# Altium schematic sheet Peripherals.SchDoc
size A4
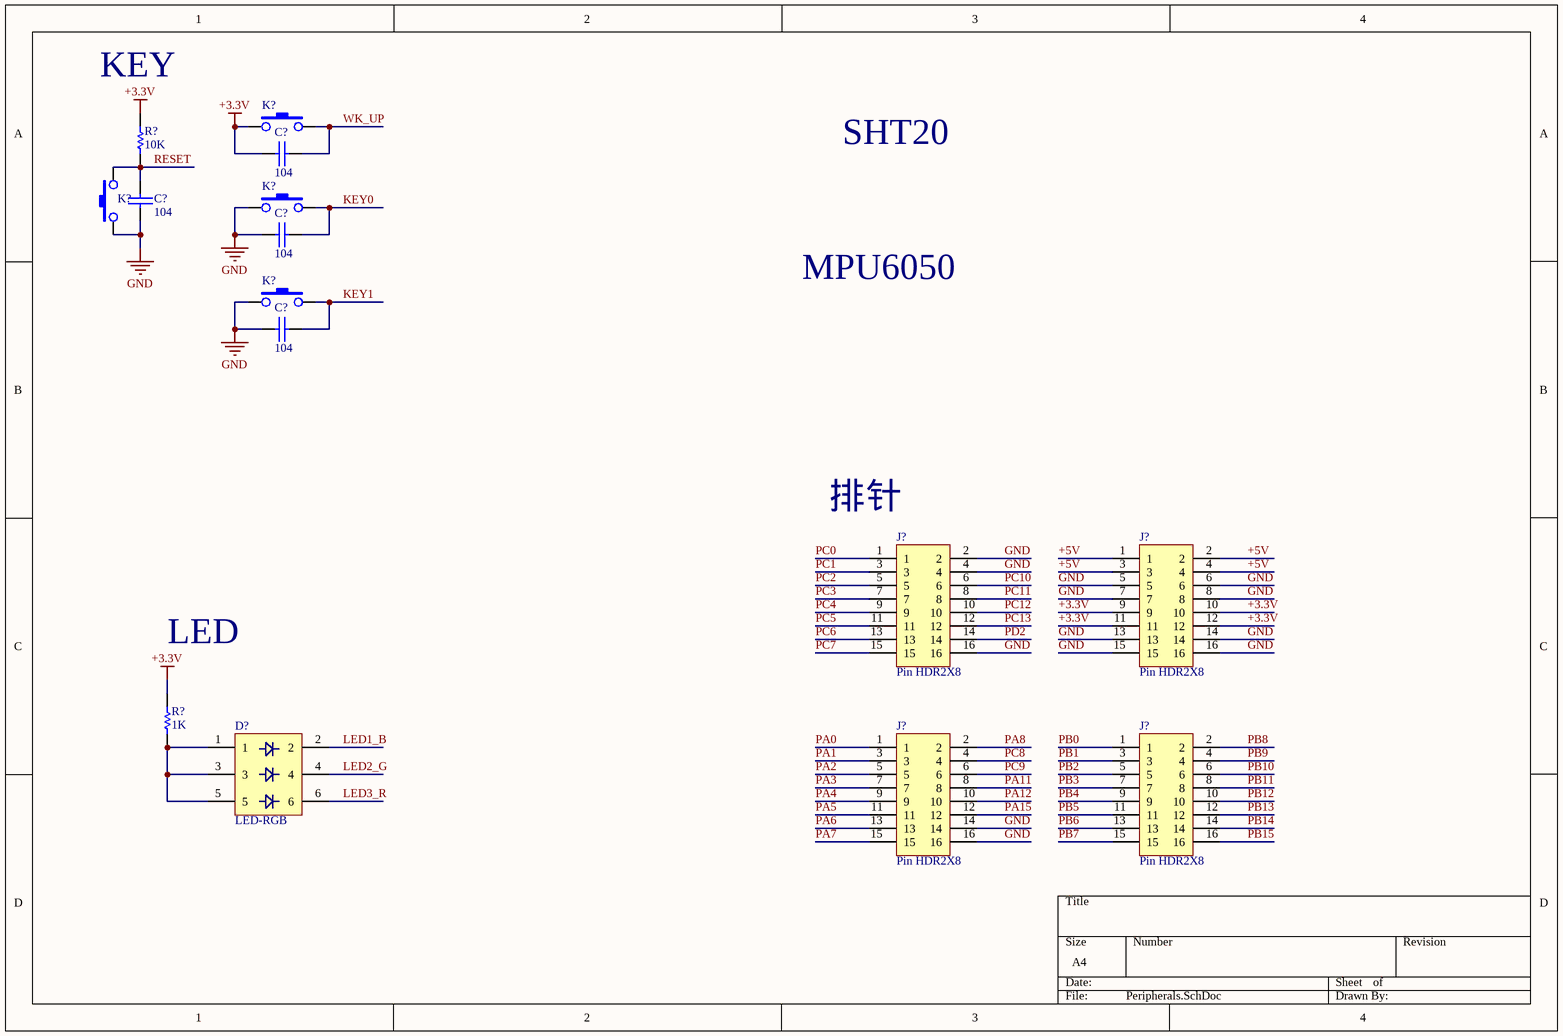
[diagram p0: Peripherals.SchDoc]

## Parts
(Parts that share a designator on the sheet are numbered #1, #2 ... from top to bottom, then left to right.)
C?#1  104  [0603C]
C?#2  104  [0603C]
C?#3  104  [0603C]
C?#4  104  [0603C]
D?  LED-RGB  [LED-5050W]
J?#1  Pin HDR2X8  [Pin HDR2X8/2.54mm-S]
J?#2  Pin HDR2X8  [Pin HDR2X8/2.54mm-S]
J?#3  Pin HDR2X8  [Pin HDR2X8/2.54mm-S]
J?#4  Pin HDR2X8  [Pin HDR2X8/2.54mm-S]
K?#1  KEY  [DIP-6X6X5]  (value not drawn)
K?#2  KEY  [DIP-6X6X5]  (value not drawn)
K?#3  KEY  [DIP-6X6X5]  (value not drawn)
K?#4  KEY  [DIP-6X6X5]  (value not drawn)
R?#1  10K  [0603R]
R?#2  1K  [0603R]

## Nets
+3.3V: C?#1.1 J?#2.9 J?#2.10 J?#2.11 J?#2.12 K?#1.1 R?#1.2 R?#2.2
GND: C?#2.1 C?#3.1 C?#4.1 J?#1.2 J?#1.4 J?#1.16 J?#2.5 J?#2.6 J?#2.7 J?#2.8 J?#2.13 J?#2.14 J?#2.15 J?#2.16 J?#3.14 J?#3.16 K?#2.1 K?#3.1 K?#4.1
+5V: J?#2.1 J?#2.2 J?#2.3 J?#2.4
KEY0: C?#3.2 K?#2.3
KEY1: C?#4.2 K?#4.3
LED1_B: D?.2
LED2_G: D?.4
LED3_R: D?.6
PA0: J?#3.1
PA1: J?#3.3
PA2: J?#3.5
PA3: J?#3.7
PA4: J?#3.9
PA5: J?#3.11
PA6: J?#3.13
PA7: J?#3.15
PA8: J?#3.2
PA11: J?#3.8
PA12: J?#3.10
PA15: J?#3.12
PB0: J?#4.1
PB1: J?#4.3
PB2: J?#4.5
PB3: J?#4.7
PB4: J?#4.9
PB5: J?#4.11
PB6: J?#4.13
PB7: J?#4.15
PB8: J?#4.2
PB9: J?#4.4
PB10: J?#4.6
PB11: J?#4.8
PB12: J?#4.10
PB13: J?#4.12
PB14: J?#4.14
PB15: J?#4.16
PC0: J?#1.1
PC1: J?#1.3
PC2: J?#1.5
PC3: J?#1.7
PC4: J?#1.9
PC5: J?#1.11
PC6: J?#1.13
PC7: J?#1.15
PC8: J?#3.4
PC9: J?#3.6
PC10: J?#1.6
PC11: J?#1.8
PC12: J?#1.10
PC13: J?#1.12
PD2: J?#1.14
RESET: C?#2.2 K?#3.3 R?#1.1
WK_UP: C?#1.2 K?#1.3
NetD?_1: D?.1 D?.3 D?.5 R?#2.1

## Notes on the sheet
- (near R?#1) KEY
- SHT20
- MPU6050
- (near J?#1) 排针
- LED

## Library data of the parts
C?#1-C?#4 = CAP: 无极性电容
D? = LED-5050
R?#1 R?#2 = RES